# Altium schematic sheet APP_1_Connectors_m.SchDoc
size Tabloid; SheetNumber: 4; SheetTotal: 16; Sheet_Name: Connectors_m; Size: 11x17
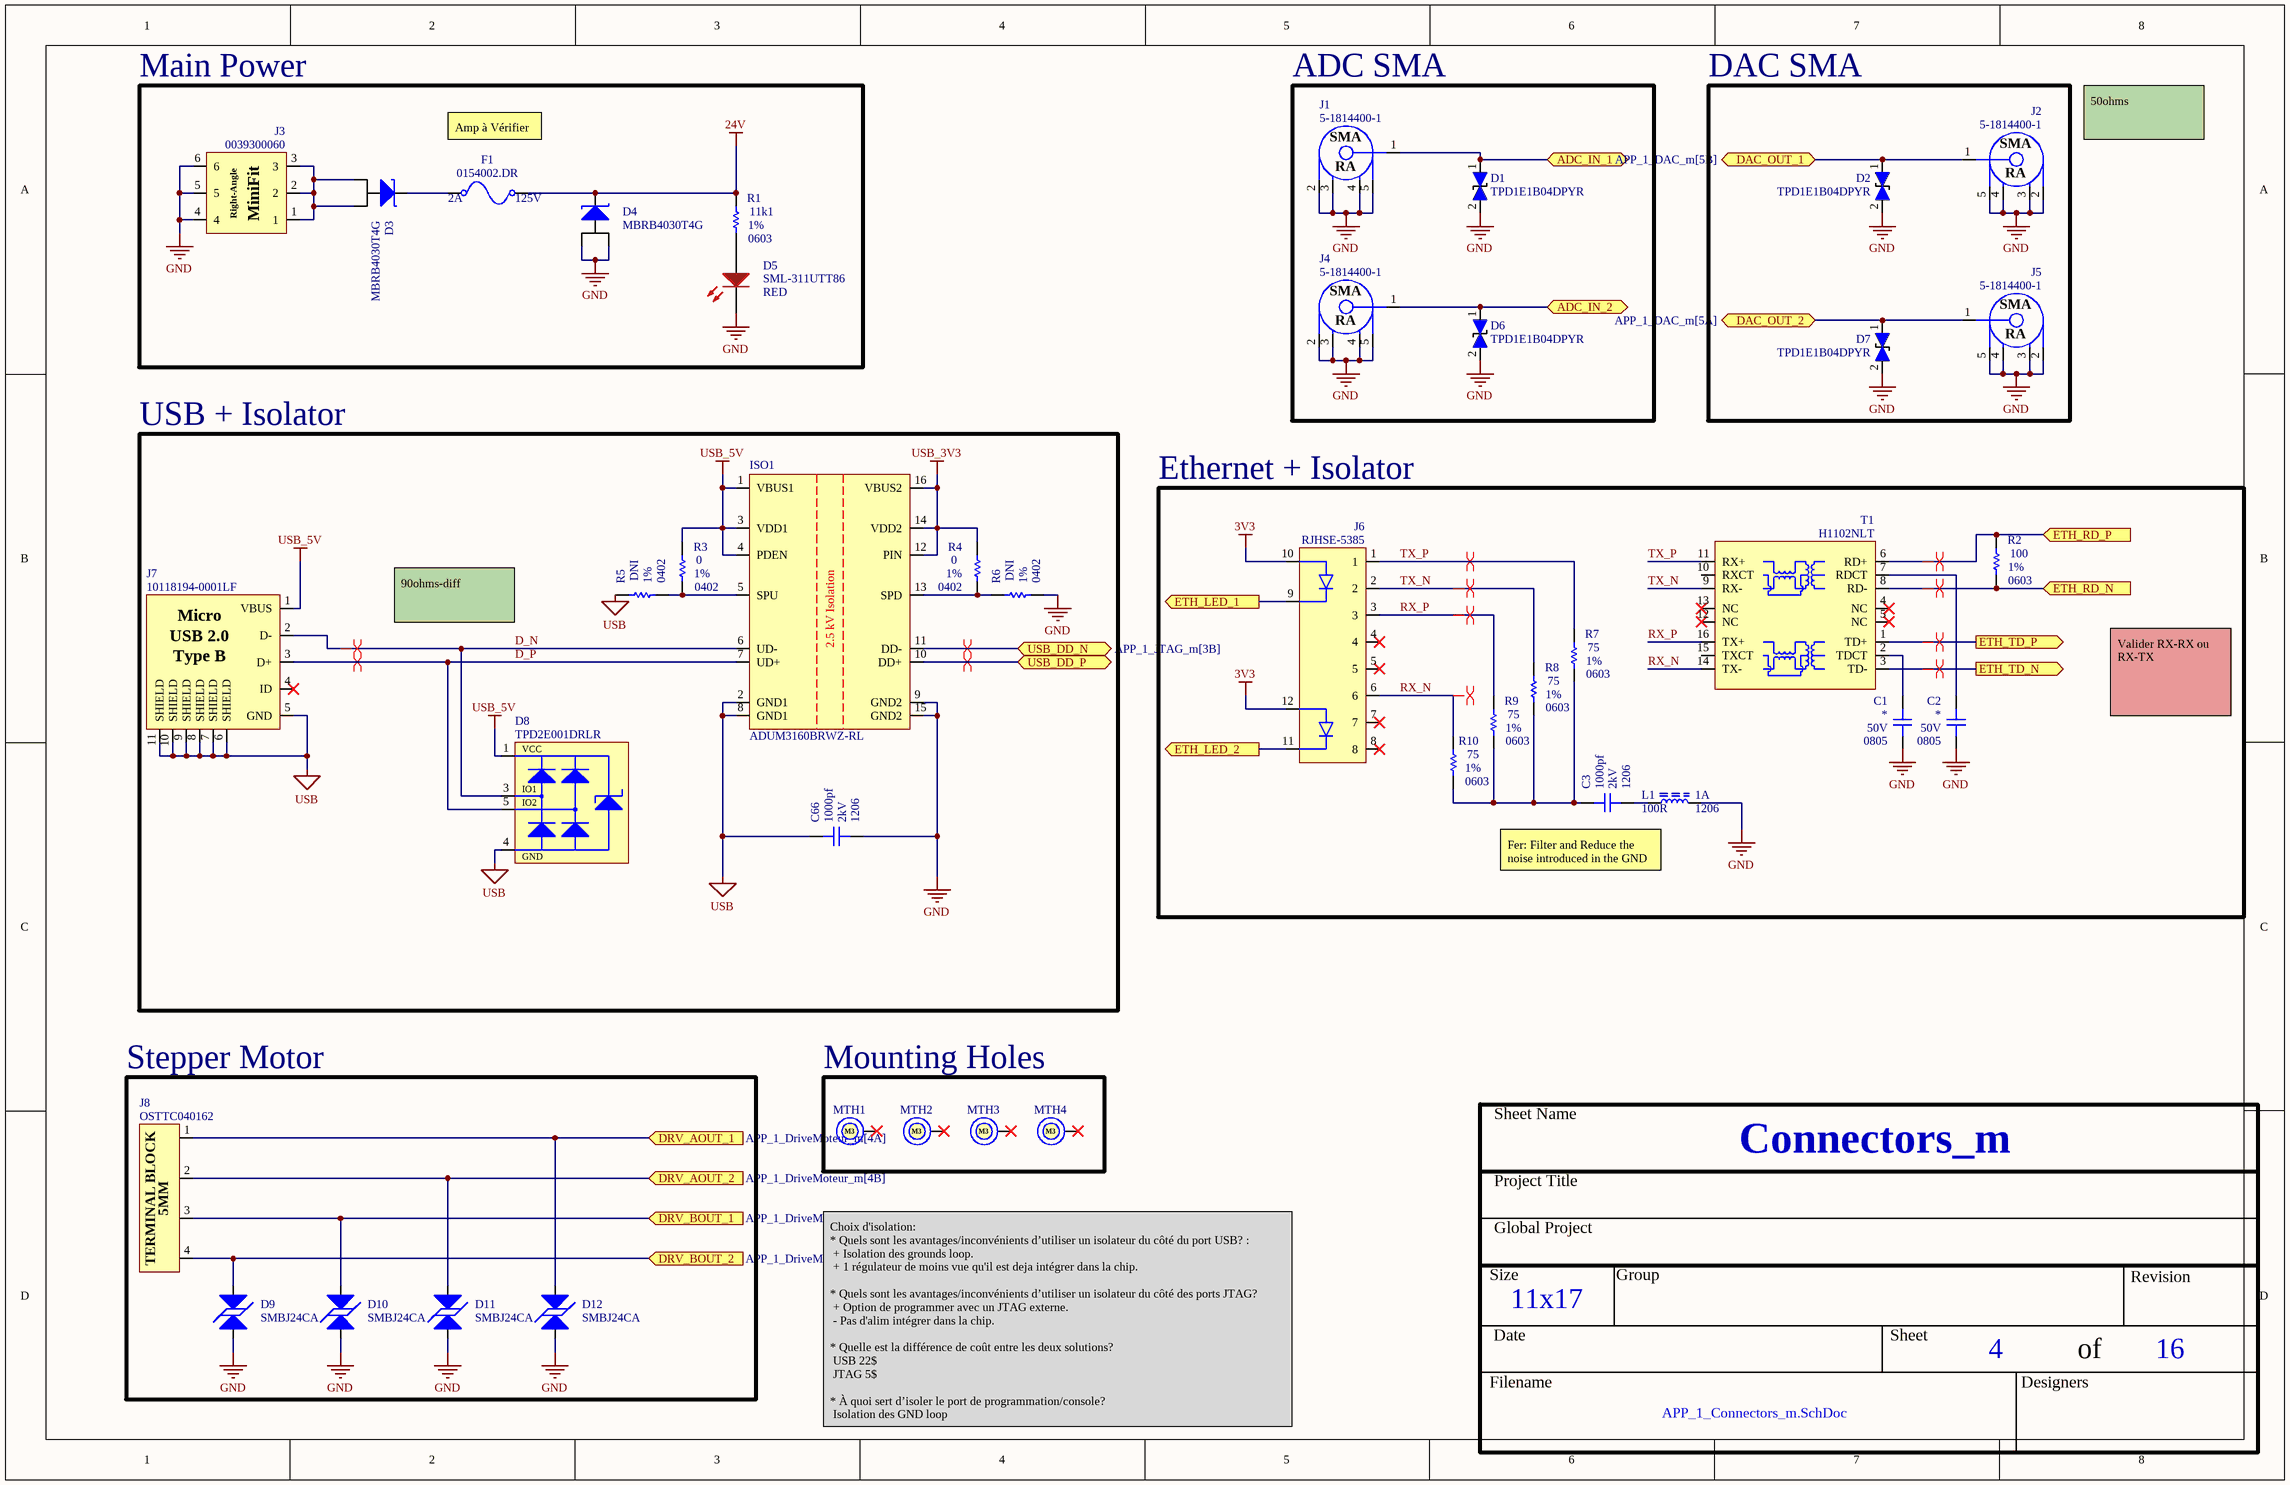
[diagram p0: APP_1_Connectors_m.SchDoc]

## Parts
C1  Voltage: 50V  Package: 0805  [CAP_0805]  (hidden comment: CAP - 0805)
C2  Voltage: 50V  Package: 0805  [CAP_0805]  (hidden comment: CAP - 0805)
C3  value 1000pf  Voltage: 2kV  Package: 1206  [CAP_1206]  (hidden comment: CAP - 1206)
C66  value 1000pf  Voltage: 2kV  Package: 1206  [CAP_1206]  (hidden comment: CAP - 1206)
D1  TPD1E1B04DPYR  [TVS_DATA_TPD1E1B04DPYR]
D2  TPD1E1B04DPYR  [TVS_DATA_TPD1E1B04DPYR]
D3  MBRB4030T4G  [DIO_SCHOTTKY_MBRB4030T4G]
D4  MBRB4030T4G  [DIO_SCHOTTKY_MBRB4030T4G]
D5  SML-311UTT86  value RED  [LED_0603]
D6  TPD1E1B04DPYR  [TVS_DATA_TPD1E1B04DPYR]
D7  TPD1E1B04DPYR  [TVS_DATA_TPD1E1B04DPYR]
D8  TPD2E001DRLR  [TVS_USB_TPD2E001DRLR]
D9  SMBJ24CA  [TVS_PWR_SMBJ36CA]
D10  SMBJ24CA  [TVS_PWR_SMBJ36CA]
D11  SMBJ24CA  [TVS_PWR_SMBJ36CA]
D12  SMBJ24CA  [TVS_PWR_SMBJ36CA]
F1  0154002.DR  Voltage Rating: 125V  Current Rating: 2A  [FUS_0154XXX.DR]
ISO1  ADUM3160BRWZ-RL  [ISO_ADUM3160BRWZ-RL]
J1  5-1814400-1  [CONN_SMA_5-1814400-1]
J2  5-1814400-1  [CONN_SMA_5-1814400-1]
J3  0039300060  [CON_MINIFIT_0039300060]
J4  5-1814400-1  [CONN_SMA_5-1814400-1]
J5  5-1814400-1  [CONN_SMA_5-1814400-1]
J6  RJHSE-5385  [CONN_ETHERNET_RJHSE-5385]
J7  10118194-0001LF  [CON_USB_10118194-0001LF]
J8  OSTTC040162  [CONN_TERMINAL_OSTTA040161]
L1  value 100R  Current: 1A  Package: 1206  [FER_1206]  (hidden comment: FER - 1206)
MTH1  M3  [MTH_M3]  (no BOM)
MTH2  M3  [MTH_M3]  (no BOM)
MTH3  M3  [MTH_M3]  (no BOM)
MTH4  M3  [MTH_M3]  (no BOM)
R1  value 11k1  Package: 0603  Precision: 1%  [RES_0603]  (hidden comment: RES - 0603)
R2  value 100  Package: 0603  Precision: 1%  [RES_0603]  (hidden comment: RES - 0603)
R3  value 0  Package: 0402  Precision: 1%  [RES_0402]  (hidden comment: RES - 0402)
R4  value 0  Package: 0402  Precision: 1%  [RES_0402]  (hidden comment: RES - 0402)
R5  value DNI  Package: 0402  Precision: 1%  [RES_0402]  (hidden comment: RES - 0402)
R6  value DNI  Package: 0402  Precision: 1%  [RES_0402]  (hidden comment: RES - 0402)
R7  value 75  Package: 0603  Precision: 1%  [RES_0603]  (hidden comment: RES - 0603)
R8  value 75  Package: 0603  Precision: 1%  [RES_0603]  (hidden comment: RES - 0603)
R9  value 75  Package: 0603  Precision: 1%  [RES_0603]  (hidden comment: RES - 0603)
R10  value 75  Package: 0603  Precision: 1%  [RES_0603]  (hidden comment: RES - 0603)
T1  H1102NLT  [TRANSFO_H1102NLT]

## Blocks framed on the sheet
Main Power: D3-D5 F1 J3 R1
ADC SMA: D1 D6 J1 J4
DAC SMA: D2 D7 J2 J5
USB + Isolator: C66 D8 ISO1 J7 R3-R6
Ethernet + Isolator: C1-C3 J6 L1 R2 R7-R10 T1
Stepper Motor: D9-D12 J8
Mounting Holes: MTH1-MTH4

## Ports
ADC_IN_1 (bidir, see APP_1_ADC_m[1B]), ADC_IN_2 (bidir, see APP_1_ADC_m[1A]), DAC_OUT_1 (bidir, see APP_1_DAC_m[5B]), DAC_OUT_2 (bidir, see APP_1_DAC_m[5A]), DRV_AOUT_1 (in, see APP_1_DriveMoteur_m[4A]), DRV_AOUT_2 (in, see APP_1_DriveMoteur_m[4B]), DRV_BOUT_1 (in, see APP_1_DriveMoteur_m[4B]), DRV_BOUT_2 (in, see APP_1_DriveMoteur_m[4C]), ETH_LED_1 (out), ETH_LED_2 (out), ETH_RD_N (in, see APP_1_Ethernet_m[3B]), ETH_RD_P (in, see APP_1_Ethernet_m[3B]), ETH_TD_N (out, see APP_1_Ethernet_m[3B]), ETH_TD_P (out, see APP_1_Ethernet_m[3B]), USB_DD_N (bidir, see APP_1_JTAG_m[3B]), USB_DD_P (bidir, see APP_1_JTAG_m[3B])

## Nets
3V3: J6.10(LED1_A) J6.12(LED2_A)
24V: D4.4 F1.2 R1.2
GND: C1.1 C2.1 C66.1 D1.2(i/o) D2.2(i/o) D4.1(A) D4.3 D5.K D6.2(i/o) D7.2(i/o) D9.2 D10.2 D11.2 D12.2 ISO1.9(GND2) ISO1.15(GND2) J1.2 J1.3 J1.4 J1.5 J2.2 J2.3 J2.4 J2.5 J3.4 J3.5 J3.6 J4.2 J4.3 J4.4 J4.5 J5.2 J5.3 J5.4 J5.5 L1.1 R6.1
USB: C66.2 D8.4(GND) ISO1.2(GND1) ISO1.8(GND1) J7.5(GND) J7.6(SHIELD) J7.7(SHIELD) J7.8(SHIELD) J7.9(SHIELD) J7.10(SHIELD) J7.11(SHIELD) R5.2
USB_3V3: ISO1.12(PIN) ISO1.14(VDD2) ISO1.16(VBUS2) R4.2
USB_5V: D8.1(VCC) ISO1.1(VBUS1) ISO1.3(VDD1) ISO1.4(PDEN) J7.1(VBUS) R3.2
ADC_IN_1: D1.1(i/o) J1.1 ; port ADC_IN_1
ADC_IN_2: D6.1(i/o) J4.1 ; port ADC_IN_2
D_N: D8.3(IO1) ISO1.6(UD-) J7.2(D-)
D_P: D8.5(IO2) ISO1.7(UD+) J7.3(D+)
DAC_OUT_1: D2.1(i/o) J2.1 ; port DAC_OUT_1
DAC_OUT_2: D7.1(i/o) J5.1 ; port DAC_OUT_2
DRV_AOUT_1: D12.1 J8.1 ; port DRV_AOUT_1
DRV_AOUT_2: D11.1 J8.2 ; port DRV_AOUT_2
DRV_BOUT_1: D10.1 J8.3 ; port DRV_BOUT_1
DRV_BOUT_2: D9.1 J8.4 ; port DRV_BOUT_2
ETH_LED_1: J6.9(LED1_K) ; port ETH_LED_1
ETH_LED_2: J6.11(LED2_K) ; port ETH_LED_2
ETH_RD_N: R2.1 T1.8(RD-) ; port ETH_RD_N
ETH_RD_P: R2.2 T1.6(RD+) ; port ETH_RD_P
ETH_TD_N: T1.3(TD-) ; port ETH_TD_N
ETH_TD_P: T1.1(TD+) ; port ETH_TD_P
RX_N: J6.6 R10.2 T1.14(TX-)
RX_P: J6.3 R9.2 T1.16(TX+)
TX_N: J6.2 R8.2 T1.9(RX-)
TX_P: J6.1 R7.2 T1.11(RX+)
USB_DD_N: ISO1.11(DD-) ; port USB_DD_N
USB_DD_P: ISO1.10(DD+) ; port USB_DD_P
NetC1_2: C1.2 T1.2(TDCT)
NetC2_2: C2.2 T1.7(RDCT)
NetC3_1: C3.1 L1.2
NetC3_2: C3.2 R7.1 R8.1 R9.1 R10.1
NetD3_1: D3.1(A) D3.3 J3.1 J3.2 J3.3
NetD3_4: D3.4 F1.1
NetD5_A: D5.A R1.1
NetISO1_5: ISO1.5(SPU) R3.1 R5.1
NetISO1_13: ISO1.13(SPD) R4.1 R6.2

Not connected (* = marked no-connect by the designer): D8 2(NC); J6 4* 5* 7* 8*; J7 4(ID)*; MTH1 1*; MTH2 1*; MTH3 1*; MTH4 1*; T1 4(NC)* 5(NC)* 10(RXCT) 12(NC)* 13(NC)* 15(TXCT)

## Layout directives
differential pair: USB_DD_N, USB_DD_P
differential pair; differential pair class ETH: ETH_RD_N, ETH_RD_P, ETH_TD_N, ETH_TD_P, RX_N, RX_P, TX_N, TX_P
differential pair; differential pair class USB: D_N, D_P

## Notes on the sheet
- Amp à Vérifier
- (near J2) 50ohms
- 90ohms-diff
- Valider RX-RX ou RX-TX
- Fer: Filter and Reduce the noise introduced in the GND
- Choix d'isolation:
  * Quels sont les avantages/inconvénients d’utiliser un isolateur du côté du port USB? :
  + Isolation des grounds loop.
  + 1 régulateur de moins vue qu'il est deja intégrer dans la chip.
  * Quels sont les avantages/inconvénients d’utiliser un isolateur du côté des ports JTAG?
  + Option de programmer avec un JTAG externe.
  - Pas d'alim intégrer dans la chip.
  * Quelle est la différence de coût entre les deux solutions?
  USB 22$
  JTAG 5$
  * À quoi sert d’isoler le port de programmation/console?
  Isolation des GND loop
- Sheet Name
- Project Title
- Global Project
- Size
- Group
- Revision
- Date
- Sheet
- of
- Filename
- Designers
- (in symbol CON_MINIFIT_0039300060) Right-Angle; MiniFit
- (in symbol CON_USB_10118194-0001LF) Micro; USB 2.0; Type B
- (in symbol CONN_SMA_5-1814400-1) SMA; RA
- (in symbol CONN_TERMINAL_OSTTC040162) TERMINAL BLOCK; 5MM
- (in symbol ISO_ADUM3160BRWZ-RL) 2.5 kV Isolation

## Library data of the parts
C1 C2 = CAP - 0805: Precision: 10%; Current: *; CreatedBy: Jonathan Bouchard; Power: *; Value: *
C3 C66 = CAP - 1206: Precision: 10%; Current: *; CreatedBy: Jonathan Bouchard; Power: *
D1 D2 D6 D7 = TVS_DATA_TPD1E1B04DPYR: TVS - TVS DIODE 3.6V 8.5V - 0402; Manufacturer #1: Texas Instruments; Current Rating: 6.3Apeak; Power Max: 50Wpeak; GRAMS Lib Spec: 2.8; Magnetic Material: Unknown; Polarized: No; Value: *; Tolerance: *; Voltage Rating: 3.6V; HelpURL: http://www.ti.com/lit/ds/symlink/tpd1e1b04.pdf; CreatedBy/Date: Keven Deslandes - 2018/10/19; VerifiedBy: Caroline Paulin - 28 janv 2019; Temperature: -40°C ~ 125°C (TA); Package: 0402; Manufacturer #2: *; Note: *; Assembly Type: SMD; Part Number #2: *; Part Number #1: TPD1E1B04DPYR; Supplier 1: Digi-Key; Supplier Part Number 1: 296-47364-1-ND; Cryo: UNKNOWN
D3 D4 = DIO_SCHOTTKY_MBRB4030T4G: DIO - 30V MAX 40 A - TO-263-3; Manufacturer #1: ON Semiconductor; Value: Vf = 550mV @ 40A; Current Rating: 40A; GRAMS Lib Spec: 2.8; Magnetic Material: NO; Polarized: Yes; Cryo: UNKNOWN; Tolerance: *; Voltage Rating: 30V; Power Max: *; HelpURL: http://www.onsemi.com/pub/Collateral/MBRB4030-D.PDF; CreatedBy/Date: Arnaud Samson - 06/07/18; VerifiedBy: Jonathan Bouchard 2018-07-12; Temperature: -65°C ~ 175°C; Package: D2PAK; Manufacturer #2: *; Note: *; Assembly Type: SMD; Part Number #2: *; Part Number #1: MBRB4030T4G; Supplier 1: Digi-Key; Supplier Part Number 1: MBRB4030T4GOSCT-ND
D5 = LED_SML-311UTT86: LED - 620nM RED 2mA - 0603; Voltage: 1.8V; Mfg: ROHM Semiconductor; Power: 44mW; Current: 2mA; HelpURL: http://media.digikey.com/pdf/Data%20Sheets/Rohm%20PDFs/SML-311%20Series.pdf; CreatedBy: Jonathan Bouchard; Temperature: -30°C to 85°C; Package: 0603; Precision: *; Mfg Part Number: SML-311UTT86; Supplier 1: Digikey; Supplier Part Number 1: 511-1304-1-ND
D8 = TVS_USB_TPD2E001DRLR: TVS - USB TVS DIODE 5.5V - SOT-553; Manufacturer #1: Texas Instruments; Value: 11V Breakdown; Voltage Rating: 5.5V (Max); GRAMS Lib Spec: 2.8; Magnetic Material: YES; Cryo: UNKNOWN; Tolerance: *; Current Rating: *; Power Max: *; HelpURL: http://www.ti.com/lit/ds/symlink/tpd2e001.pdf; CreatedBy/Date: Jonathan Bouchard 2018-07-10; VerifiedBy: Arnaud Samson 16-07-18; Temperature: -40°C ~ 85°C (TA); Package: SOT-553; Manufacturer #2: *; Note: *; Assembly Type: SMD; Part Number #2: *; Part Number #1: TPD2E001DRLR; Polarized: YES; Supplier 1: Digi-Key; Supplier Part Number 1: 296-21883-1-ND
D9-D12 = TVS_PWR_SMBJ24CA: TVS - 24V 26.7V 600W - DO214AA; Manufacturer #1: Littelfuse Inc.; Value: Vbr = 26.7V -  Clamp = 38.9V; Voltage Rating: 24V Standoff; Current Rating: 15.5A; GRAMS Lib Spec: 2.8; Magnetic Material: UNKNOWN; Polarized: NO; Tolerance: *; Power Max: 600W; HelpURL: http://www.littelfuse.com/~/media/electronics/datasheets/tvs_diodes/littelfuse_tvs_diode_smbj_datasheet.pdf.pdf; CreatedBy/Date: Arnaud Samson - 06/07/18; VerifiedBy: Jonathan Bouchard - 2018-07-13; Temperature: -65°C ~ 150°C (TJ); Package: DO214AA; Manufacturer #2: *; Note: *; Assembly Type: SMD; Part Number #2: *; Part Number #1: SMBJ24CA; Supplier 1: Digi-Key; Supplier Part Number 1: SMBJ24CALFCT-ND; Cryo: UNKNOWN
F1 = FUS_0154002.DR: FUS - 2 A 125 VAC/VDC - 2-SMD; Manufacturer #1: Littelfuse Inc.; Value: 2A 125V AC/DC FAST; GRAMS Lib Spec: 2.8; Magnetic Material: UNKNOWN; Polarized: NO; Tolerance: *; Power Max: *; HelpURL: http://www.littelfuse.com/~/media/electronics/datasheets/fuses/littelfuse_fuse_154_154t_154l_154tl_datasheet.pdf.pdf; CreatedBy/Date: Jonathan Bouchard 2018-07-17; VerifiedBy: Arnaud Samson 23-07-18; Temperature: -55°C ~ 125°C; Package: 2-SMD; Manufacturer #2: *; Note: *; Assembly Type: SMD; Part Number #2: *; Part Number #1: 0154002.DR; Supplier 1: Digi-Key; Supplier Part Number 1: F1224CT-ND; Cryo: UNKNOWN
ISO1 = ISO_ADUM3160BRWZ-RL: ISO - DGTL ISO 2.5KV 2CH USB - 16SOIC; Manufacturer #1: Analog Devices; Value: 2500Vrms voltage isolation; Voltage Rating: 3~5.5V; GRAMS Lib Spec: 2.8; Magnetic Material: UNKNOWN; Polarized: Yes; Tolerance: *; Current Rating: *; Power Max: *; HelpURL: https://www.analog.com/media/en/technical-documentation/data-sheets/ADuM3160.pdf; CreatedBy/Date: Tommy Rossignol 2018-11-16; VerifiedBy: Caroline Paulin - 13 février 2019; Temperature: -40°C ~ 105°C; Package: 16-SOIC; Manufacturer #2: *; Assembly Type: SMD; Part Number #2: *; Part Number #1: ADUM3160BRWZ-RL; Supplier 1: Digi-Key; Supplier Part Number 1: ADUM3160BRWZ-RLCT-ND; Cryo: UNKNOWN
J1 J2 J4 J5 = CONN_SMA_5-1814400-1: CONN -  SMA JACK R/A 50 OHM - TH; Mfg: TE Connectivity AMP Connectors; Voltage: *; Current: *; Power: *; Mfg Part Number: 5-1814400-1; HelpURL: http://www.te.com/commerce/DocumentDelivery/DDEController?Action=srchrtrv&DocNm=1814400&DocType=Customer+Drawing&DocLang=English; CreatedBy: Jonathan Bouchard; Temperature: -55°C ~ 85°C; Value: *; Precision: *; Package: TH-5; Supplier 1: Digikey; Supplier Part Number 1: A97593-ND
J3 = CON_MINIFIT_0039300060: CON - Mini-Fit Through Hole, Right Angle 6 position; Manufacturer #1: Molex; Current Rating: 8A; GRAMS Lib Spec: 2.8; Magnetic Material: Unknown; Polarized: Yes; Voltage Rating: 600V; Assembly Type: TH; CreatedBy/Date: Joel Lemay 2018-06-21; HelpURL: https://www.molex.com/pdm_docs/sd/039300060_sd.pdf; Manufacturer #2: *; Package: TH; Part Number #1: 0039300060; Part Number #2: *; Power Max: *; Supplier 1: Digi-Key; Supplier Part Number 1: WM21353-ND; Temperature: - 40°C to + 80°C; Tolerance: *; Value: *; VerifiedBy: Caroline Paulin - 10 sept 2018; Cryo: UNKNOWN
J6 = CONN_ETHERNET_RJHSE-5385: CONN - MOD JACK RJ45 R/A ETHERNET - TH; Mfg: Amphenol; Voltage: *; Current: *; Power: *; Mfg Part Number: RJHSE-5385; HelpURL: https://www.amphenolcanada.com/ProductSearch/drawings/AC/RJHSE538X.pdf; CreatedBy: Jonathan Bouchard; Temperature: -55°C ~ 85°C; Value: *; Precision: *; Package: TH-12; Supplier 1: Digikey; Supplier Part Number 1: RJHSE-5385-ND
J7 = CON_USB_10118194-0001LF: CON - USB MICRO B RECPT SMT R/A - 4PIN; Manufacturer #1: Amphenol FCI; Value: USB - Micro B; Voltage Rating: 100VAC; Current Rating: 1.8A; GRAMS Lib Spec: 2.8; Magnetic Material: YES; Cryo: UNKNOWN; Tolerance: *; Power Max: *; HelpURL: https://cdn.amphenol-icc.com/media/wysiwyg/files/drawing/10118194.pdf; CreatedBy/Date: Arnaud Samson - 09/07/18; VerifiedBy: Jonathan Bouchard 2018-07-12; Temperature: -30°C ~ 80°C; Package: 5-SMD; Manufacturer #2: *; Note: *; Assembly Type: SMD; Part Number #2: *; Part Number #1: 10118194-0001LF; Polarized: YES; Supplier 1: Digi-Key; Supplier Part Number 1: 609-4618-1-ND
J8 = CONN_TERMINAL_OSTTC040162: CONN -  TERMINAL BLOCK 4POS 5MM - TH; Mfg: On Shore Technology Inc.; Voltage: *; Current: *; Power: *; Mfg Part Number: OSTTC040162; HelpURL: http://www.on-shore.com/wp-content/uploads/2015/09/osttcxx0162.pdf; CreatedBy: Jonathan Bouchard; Temperature: -30°C ~ 105°C; Value: *; Precision: *; Package: TH-4; Supplier 1: Digikey; Supplier Part Number 1: ED2602-ND
MTH1-MTH4 = MTH_M3: MTH - MOUNTING HOLE M3 PLATED - M3; GRAMS Lib Spec: 2.8; Magnetic Material: NO; Cryo: UNKNOWN; Value: *; Tolerance: *; Voltage Rating: *; Current Rating: *; Power Max: *; HelpURL: https://littlemachineshop.com/images/gallery/PDF/TapDrillSizes.pdf; CreatedBy/Date: Jonathan Bouchard 2018-07-23; VerifiedBy: Arnaud Samson 23-07-18; Temperature: *; Package: M3; Manufacturer #1: *; Manufacturer #2: *; Note: *; Assembly Type: NONE; Part Number #2: *; Part Number #1: *; Polarized: *; Supplier 1: *; Supplier Part Number 1: *
R3 R4 = RES - 0402: Voltage: 50V; Current: DNI; Power: 1/16W; CreatedBy: Jonathan Bouchard
R5 R6 = RES - 0402: Voltage: 50V; Power: 1/16W; Current: DNI; CreatedBy: Jonathan Bouchard
T1 = TRANSFO_H1102NLT: TRANSFO - ETHERNET 10/100B-TX - SMD-16; Mfg: Pulse Eng.; Value: 1:1 (350uH); Voltage: *; Current: *; Power: *; Mfg Part Number: H1102NLT; HelpURL: http://media.digikey.com/pdf/Data%20Sheets/Pulse%20PDFs/10_100BASE-T%20Single%20Port%20SMD%20Magnetics_Rev2008.pdf; CreatedBy: Jonathan Bouchard; Temperature: -40°C to 85°C; Precision: *; Package: SMD-16; Supplier 1: Digikey; Supplier Part Number 1: 553-1532-1-ND
L1 = FER - 1206: Voltage: *; CreatedBy: Jonathan Bouchard; Power: *; Precision: *
R1 R2 R7-R10 = RES - 0603: Current: *; CreatedBy: Jonathan Bouchard